# EAGLE design My_Smart_Home_Rev2 (EAGLE 7.1.0)
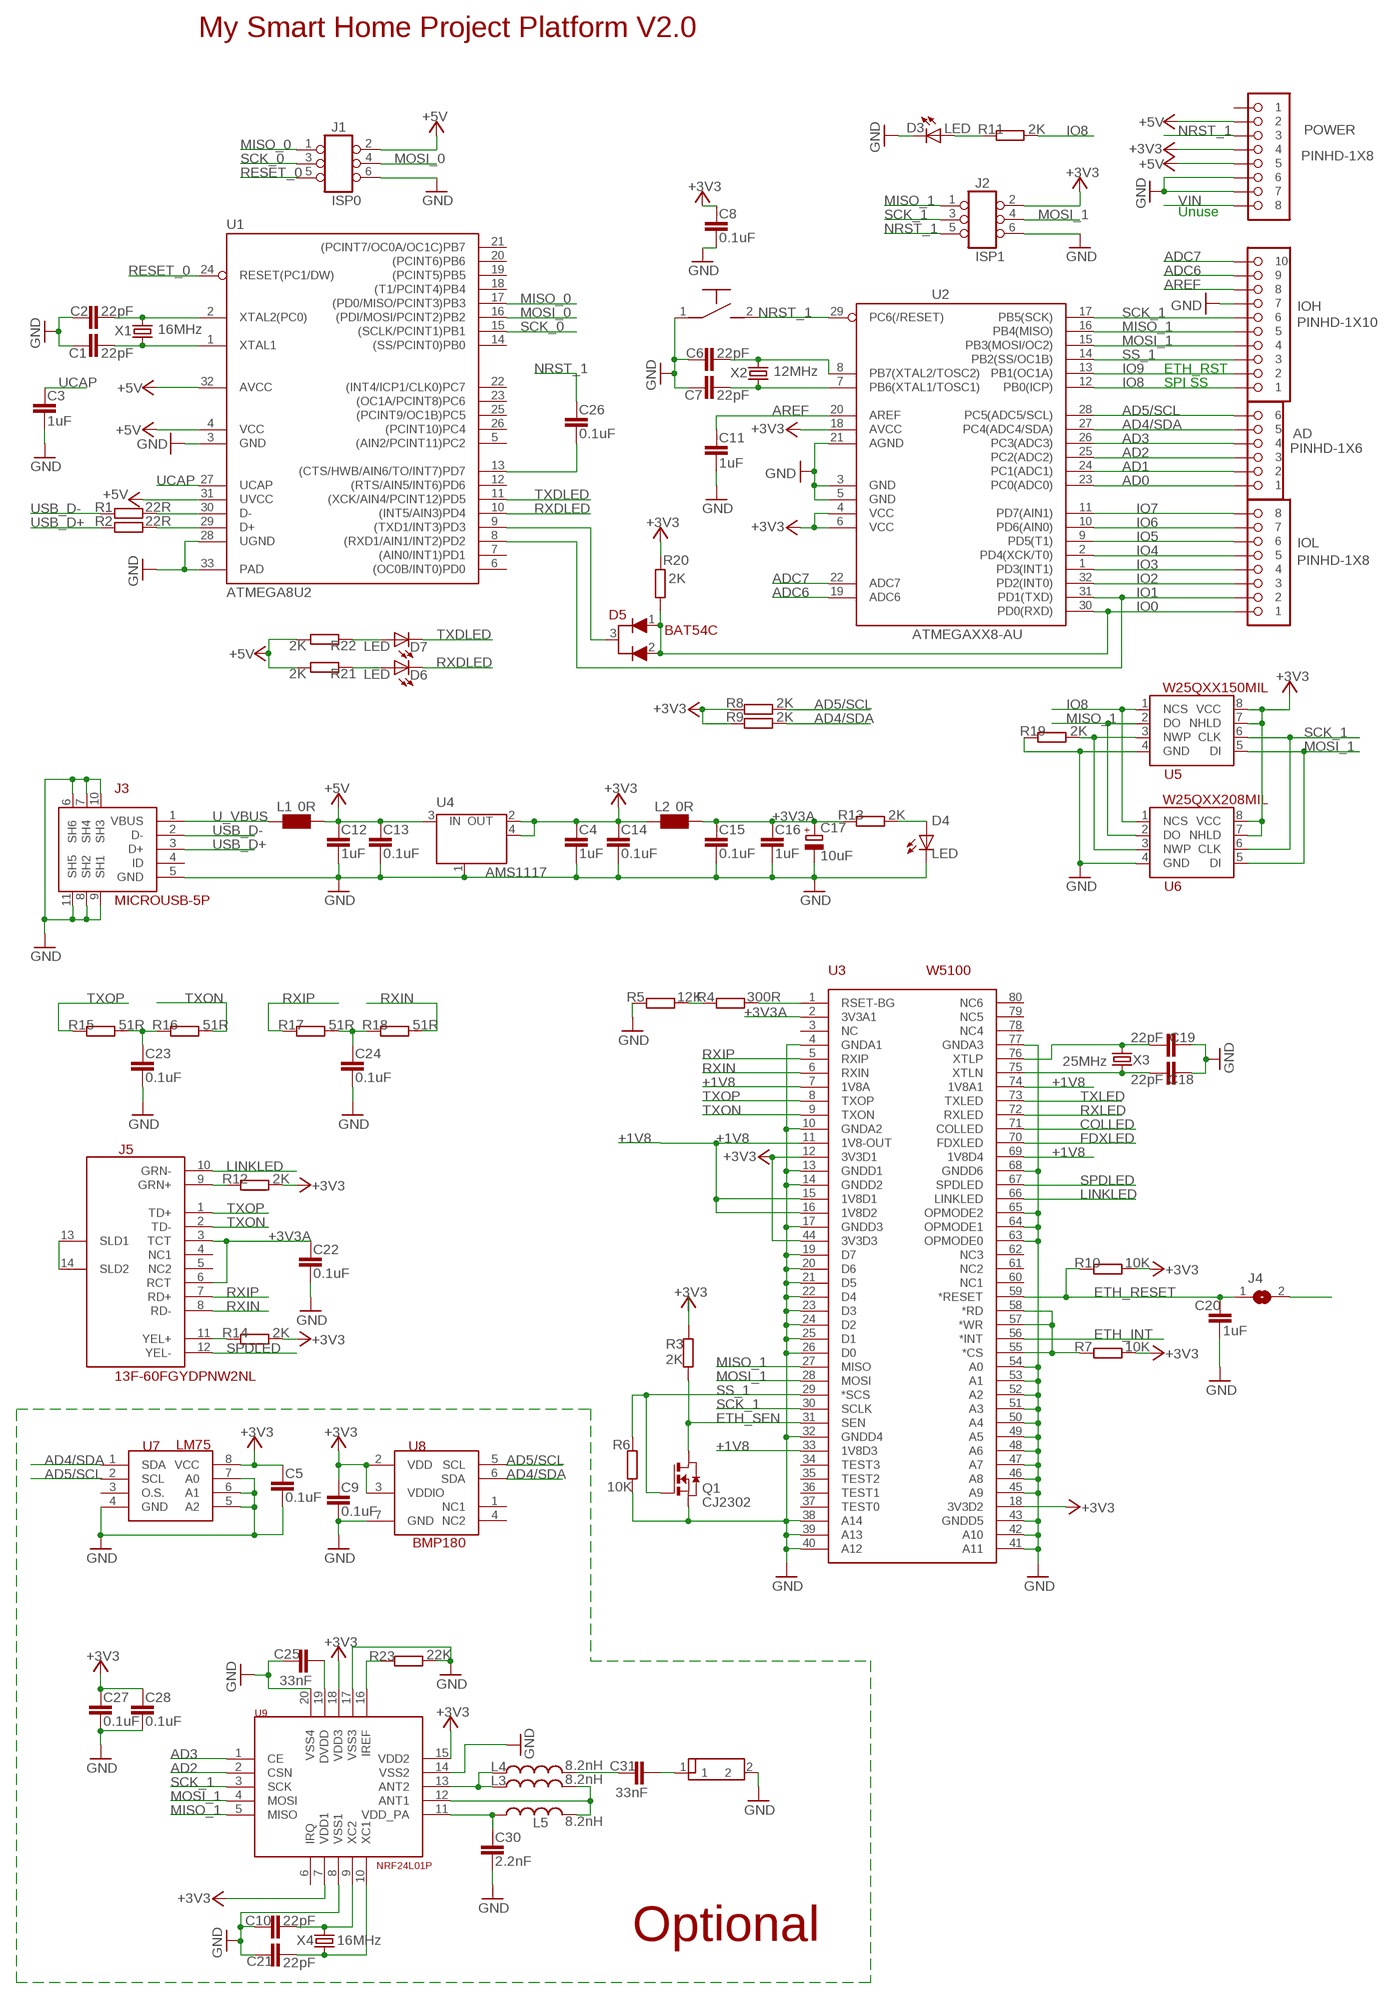
[diagram p0: schematic, sheet 1]

## Parts
AD  PINHD-1X6  [1X06]
ANT1  2.4G_ANT1  [2.4G_PCB_ANT]
C1  22pF  C-NP  [C0603]
C2  22pF  C-NP  [C0603]
C3  1uF  C-NP  [C0603]
C4  1uF  C-NP  [C0603]
C5  0.1uF  C-NP  [C0603]
C6  22pF  C-NP  [C0603]
C7  22pF  C-NP  [C0603]
C8  0.1uF  C-NP  [C0603]
C9  0.1uF  C-NP  [C0603]
C10  22pF  C-NP  [C0603]
C11  1uF  C-NP  [C0603]
C12  1uF  C-NP  [C0603]
C13  0.1uF  C-NP  [C0603]
C14  0.1uF  C-NP  [C0603]
C15  0.1uF  C-NP  [C0603]
C16  1uF  C-NP  [C0603]
C17  10uF  C-POL  [C0805]
C18  22pF  C-NP  [C0603]
C19  22pF  C-NP  [C0603]
C20  1uF  C-NP  [C0603]
C21  22pF  C-NP  [C0603]
C22  0.1uF  C-NP  [C0603]
C23  0.1uF  C-NP  [C0603]
C24  0.1uF  C-NP  [C0603]
C25  33nF  C-NP  [C0603]
C26  0.1uF  C-NP  [C0603]
C27  0.1uF  C-NP  [C0603]
C28  0.1uF  C-NP  [C0603]
C30  2.2nF  C-NP  [C0603]
C31  33nF  C-NP  [C0603]
D3  LED  [LED0805]
D4  LED  [LED0805]
D5  BAT54C  [SOT23]
D6  LED  [LED0805]
D7  LED  [LED0805]
IOH  PINHD-1X10  [1X10]
IOL  PINHD-1X8  [1X08]
J1  ISP0  PINHD-2X3  [2X03]
J2  ISP1  PINHD-2X3  [2X03]
J3  MICROUSB-5P  [MICROUSB-5P-SMD]
J4  JUMPER  [SOLDER_JUMPER]
J5  13F-60FGYDPNW2NL  [13F-60FGYDPNW2NL]
L1  0R  L_M  [R0603]
L2  0R  L_M  [R0603]
L3  8.2nH  L  [R0603]
L4  8.2nH  L  [R0603]
L5  8.2nH  L  [R0603]
POWER  PINHD-1X8  [1X08]
Q1  CJ2302  NMOS-SOT23  [SOT23]
R1  22R  RES  [R0603]
R2  22R  RES  [R0603]
R3  2K  RES  [R0603]
R4  300R  RES  [R0603]
R5  12K  RES  [R0603]
R6  10K  RES  [R0603]
R7  10K  RES  [R0603]
R8  2K  RES  [R0603]
R9  2K  RES  [R0603]
R10  10K  RES  [R0603]
R11  2K  RES  [R0603]
R12  2K  RES  [R0603]
R13  2K  RES  [R0603]
R14  2K  RES  [R0603]
R15  51R  RES  [R0603]
R16  51R  RES  [R0603]
R17  51R  RES  [R0603]
R18  51R  RES  [R0603]
R19  2K  RES  [R0603]
R20  2K  RES  [R0603]
R21  2K  RES  [R0603]
R22  2K  RES  [R0603]
R23  22K  RES  [R0603]
SW2  SW-2  [SW-2P-SMD]
U1  ATMEGA8U2  [MLF32]
U2  ATMEGAXX8-AU  [TQFP32-08]
U3  W5100  [SQFP-S-10X10-80]
U4  AMS1117  [SOT223]
U5  W25QXX150MIL  [8S1]
U6  W25QXX208MIL  [8S2]
U7  LM75  [8S1]
U8  BMP180  [LGA-7P]
U9  NRF24L01P  [QFN20]
X1  16MHz  CRYSTAL  [HC49UP]
X2  12MHz  CRYSTAL  [HC49UP]
X3  25MHz  CRYSTAL  [HC49UP]
X4  16MHz  CRYSTAL  [HC49UP]

## Nets
+1V8: U3.7(1V8A) U3.11(1V8-OUT) U3.15(1V8D1) U3.16(1V8D2) U3.33(1V8D3) U3.69(1V8D4) U3.74(1V8A1)
+3V3 [Power]: C4.2 C5.2 C8.2 C9.2 C14.2 C27.2 C28.2 J2.2 L2.1 POWER.4 R3.2 R7.2 R8.2 R9.2 R10.2 R12.1 R14.1 R20.2 U2.4(VCC) U2.6(VCC) U2.18(AVCC) U3.12(3V3D1) U3.18(3V3D2) U3.44(3V3D3) U4.2(OUT) U4.4(OUT) U5.7(NHLD) U5.8(VCC) U6.7(NHLD) U6.8(VCC) U7.8(VCC) U8.2(VDD) U8.3(VDDIO) U9.7(VDD1) U9.15(VDD2) U9.18(VDD3)
+3V3A [VA]: C15.2 C16.2 C17.1(+) C22.2 J5.3(TCT) J5.6(RCT) L2.2 R13.2 U3.2(3V3A1)
+5V [VA]: C12.2 C13.2 J1.2 L1.2 POWER.2 POWER.5 R21.1 R22.1 U1.4(VCC) U1.31(UVCC) U1.32(AVCC) U4.3(IN)
AD0: AD.1 U2.23(PC0(ADC0))
AD1: AD.2 U2.24(PC1(ADC1))
AD2: AD.3 U2.25(PC2(ADC2)) U9.2(CSN)
AD3: AD.4 U2.26(PC3(ADC3)) U9.1(CE)
AD4/SDA: AD.5 R9.1 U2.27(PC4(ADC4/SDA)) U7.1(SDA) U8.6(SDA)
AD5/SCL: AD.6 R8.1 U2.28(PC5(ADC5/SCL)) U7.2(SCL) U8.5(SCL)
ADC6: IOH.9 U2.19(ADC6)
ADC7: IOH.10 U2.22(ADC7)
AREF: C11.2 IOH.8 U2.20(AREF)
COLLED: U3.71(COLLED)
ETH_INT: U3.56(*INT)
ETH_RESET: C20.2 J4.1 R10.1 U3.59(*RESET)
ETH_SEN: Q1.3(D) R3.1 U3.31(SEN)
FDXLED: U3.70(FDXLED)
GND [Power]: ANT1.2 C1.1 C2.1 C3.1 C4.1 C5.1 C6.1 C7.1 C8.1 C9.1 C10.1 C11.1 C12.1 C13.1 C14.1 C15.1 C16.1 C17.2(-) C18.1 C19.1 C20.1 C21.1 C22.1 C23.1 C24.1 C25.2 C27.1 C28.1 C30.1 D3.C D4.C IOH.7 J1.6 J2.6 J3.5(GND) J3.6(SH6) J3.7(SH4) J3.8(SH2) J3.9(SH1) J3.10(SH3) J3.11(SH5) POWER.6 POWER.7 Q1.2(S) R5.1 R6.1 R19.2 R23.1 SW2.1 U1.3(GND) U1.28(UGND) U1.33(PAD) U2.3(GND) U2.5(GND) U2.21(AGND) U3.4(GNDA1) U3.10(GNDA2) U3.13(GNDD1) U3.14(GNDD2) U3.17(GNDD3) U3.19(D7) U3.20(D6) U3.21(D5) U3.22(D4) U3.23(D3) U3.24(D2) U3.25(D1) U3.26(D0) U3.32(GNDD4) U3.38(A14) U3.39(A13) U3.40(A12) U3.41(A11) U3.42(A10) U3.43(GNDD5) U3.45(A9) U3.46(A8) U3.47(A7) U3.48(A6) U3.49(A5) U3.50(A4) U3.51(A3) U3.52(A2) U3.53(A1) U3.54(A0) U3.63(OPMODE0) U3.64(OPMODE1) U3.65(OPMODE2) U3.68(GNDD6) U3.77(GNDA3) U4.1(GND/ADJ) U5.4(GND) U6.4(GND) U7.4(GND) U7.5(A2) U7.6(A1) U7.7(A0) U8.7(GND) U9.8(VSS1) U9.14(VSS2) U9.17(VSS3) U9.20(VSS4)
IO0: D5.1 D5.2 IOL.1 R20.1 U2.30(PD0(RXD))
IO1: IOL.2 U1.8((RXD1/AIN1/INT2)PD2) U2.31(PD1(TXD))
IO2: IOL.3 U2.32(PD2(INT0))
IO3: IOL.4 U2.1(PD3(INT1))
IO4: IOL.5 U2.2(PD4(XCK/T0))
IO5: IOL.6 U2.9(PD5(T1))
IO6: IOL.7 U2.10(PD6(AIN0))
IO7: IOL.8 U2.11(PD7(AIN1))
IO8: IOH.1 R11.1 U2.12(PB0(ICP)) U5.1(NCS) U6.1(NCS)
IO9: IOH.2 J4.2 U2.13(PB1(OC1A))
LINKLED: J5.10(GRN-) U3.66(LINKLED)
MISO_0: J1.1 U1.17((PD0/MISO/PCINT3)PB3)
MISO_1: IOH.5 J2.1 U2.16(PB4(MISO)) U3.27(MISO) U5.2(DO) U6.2(DO) U9.5(MISO)
MOSI_0: J1.4 U1.16((PDI/MOSI/PCINT2)PB2)
MOSI_1: IOH.4 J2.4 U2.15(PB3(MOSI/OC2)) U3.28(MOSI) U5.5(DI) U6.5(DI) U9.4(MOSI)
N$1: C2.2 U1.2(XTAL2(PC0)) X1.2
N$2: C1.2 U1.1(XTAL1) X1.1
N$3: C18.2 U3.75(XTLN) X3.2
N$4: R7.1 U3.55(*CS) U3.57(*WR) U3.58(*RD)
N$5: C19.2 U3.76(XTLP) X3.1
N$6: C10.2 U9.9(XC2) X4.2
N$7: D5.3 U1.9((TXD1/INT3)PD3)
N$8: C26.1 U1.13((CTS/HWB/AIN6/TO/INT7)PD7)
N$9: R1.2 U1.30(D-)
N$10: D7.A R22.2
N$11: R2.2 U1.29(D+)
N$12: C21.2 U9.10(XC1) X4.1
N$13: L3.1 L4.1 U9.13(ANT2)
N$14: D4.A R13.1
N$15: D3.A R11.2
N$16: C6.2 U2.8(PB7(XTAL2/TOSC2)) X2.2
N$17: C7.2 U2.7(PB6(XTAL1/TOSC1)) X2.1
N$18: R4.2 U3.1(RSET-BG)
N$19: R4.1 R5.2
N$20: J5.11(YEL+) R14.2
N$22: J5.9(GRN+) R12.2
N$23: C23.2 R15.1 R16.2
N$24: D6.A R21.2
N$25: R23.2 U9.16(IREF)
N$26: J5.13(SLD1) J5.14(SLD2)
N$27: C25.1 U9.19(DVDD)
N$28: C24.2 R17.1 R18.2
N$29: L3.2 L5.2 U9.12(ANT1)
N$30: C30.2 L5.1 U9.11(VDD_PA)
N$31: R19.1 U5.3(NWP) U6.3(NWP)
N$32: ANT1.1 C31.1
N$34: C31.2 L4.2
NRST_1: C26.2 J2.5 POWER.3 SW2.2 U2.29(PC6(/RESET))
RESET_0: J1.5 U1.24(RESET(PC1/DW))
RXDLED: D6.C U1.10((INT5/AIN3)PD4)
RXIN: J5.8(RD-) R18.1 U3.6(RXIN)
RXIP: J5.7(RD+) R17.2 U3.5(RXIP)
RXLED: U3.72(RXLED)
SCK_0: J1.3 U1.15((SCLK/PCINT1)PB1)
SCK_1: IOH.6 J2.3 U2.17(PB5(SCK)) U3.30(SCLK) U5.6(CLK) U6.6(CLK) U9.3(SCK)
SPDLED: J5.12(YEL-) U3.67(SPDLED)
SS_1: IOH.3 Q1.1(G) R6.2 U2.14(PB2(SS/OC1B)) U3.29(*SCS)
TXDLED: D7.C U1.11((XCK/AIN4/PCINT12)PD5)
TXLED: U3.73(TXLED)
TXON: J5.2(TD-) R16.1 U3.9(TXON)
TXOP: J5.1(TD+) R15.2 U3.8(TXOP)
U_VBUS: J3.1(VBUS) L1.1
UCAP: C3.2 U1.27(UCAP)
USB_D+: J3.3(D+) R2.1
USB_D-: J3.2(D-) R1.1
VIN: POWER.8
Unconnected: J3.4(ID) J5.4(NC1) J5.5(NC2) POWER.1 U1.5((AIN2/PCINT11)PC2) U1.6((OC0B/INT0)PD0) U1.7((AIN0/INT1)PD1) U1.12((RTS/AIN5/INT6)PD6) U1.14((SS/PCINT0)PB0) U1.18((T1/PCINT4)PB4) U1.19((PCINT5)PB5) U1.20((PCINT6)PB6) U1.21((PCINT7/OC0A/OC1C)PB7) U1.22((INT4/ICP1/CLK0)PC7) U1.23((OC1A/PCINT8)PC6) U1.25((PCINT9/OC1B)PC5) U1.26((PCINT10)PC4) U3.3(NC) U3.34(TEST3) U3.35(TEST2) U3.36(TEST1) U3.37(TEST0) U3.60(NC1) U3.61(NC2) U3.62(NC3) U3.78(NC4) U3.79(NC5) U3.80(NC6) U7.3(O.S.) U8.1(NC1) U8.4(NC2) U9.6(IRQ)

## Notes on the sheet
- My Smart Home Project Platform V2.0
- Unuse
- ETH_RST
- SPI SS
- Optional

## Library data of the parts
AD = Hell-Prototypes:PINHD-1X6
ANT1 = Hell-Prototypes:2.4G_ANT1
C1-C16 C18-C28 C30 C31 = Hell-Prototypes:C-NP
C17 = Hell-Prototypes:C-POL
D3 D4 D6 D7 = Hell-Prototypes:LED
D5 = Hell-Prototypes:BAT54C
IOH = Hell-Prototypes:PINHD-1X10
IOL POWER = Hell-Prototypes:PINHD-1X8
J1 J2 = Hell-Prototypes:PINHD-2X3
J3 = Hell-Prototypes:MICROUSB-5P
J4 = Hell-Prototypes:JUMPER
J5 = Hell-Prototypes:13F-60FGYDPNW2NL
L1 L2 = Hell-Prototypes:L_M
L3-L5 = Hell-Prototypes:L
Q1 = Hell-Prototypes:NMOS-SOT23
R1-R23 = Hell-Prototypes:RES
SW2 = Hell-Prototypes:SW-2
U1 = Hell-Prototypes:ATMEGA8U2
U2 = Hell-Prototypes:ATMEGAXX8: MICROCONTROLLER 8 Kbytes FLASH 1 kbytes SRAM 512 bytes EEPROM USART 6-channel 10 bit ADC 2-channel 8 bit ADC Source: avr.lbr
U3 = Hell-Prototypes:W5100
U4 = Hell-Prototypes:AMS1117
U5 U6 = Hell-Prototypes:W25QXX
U7 = Hell-Prototypes:LM75
U8 = Hell-Prototypes:BMP180
U9 = Hell-Prototypes:NRF24L01P
X1-X4 = Hell-Prototypes:CRYSTAL

## Net classes
0 default: width 0.203 mm, drill 0.406 mm, clearance 0.203 mm
1 Power: width 0.254 mm, drill 0.508 mm, clearance 0.254 mm to class 0, clearance 0.254 mm
2 VA: width 0.305 mm, drill 0.61 mm, clearance 0.203 mm to class 0, clearance 0.203 mm to class 1, clearance 0.203 mm

## Board
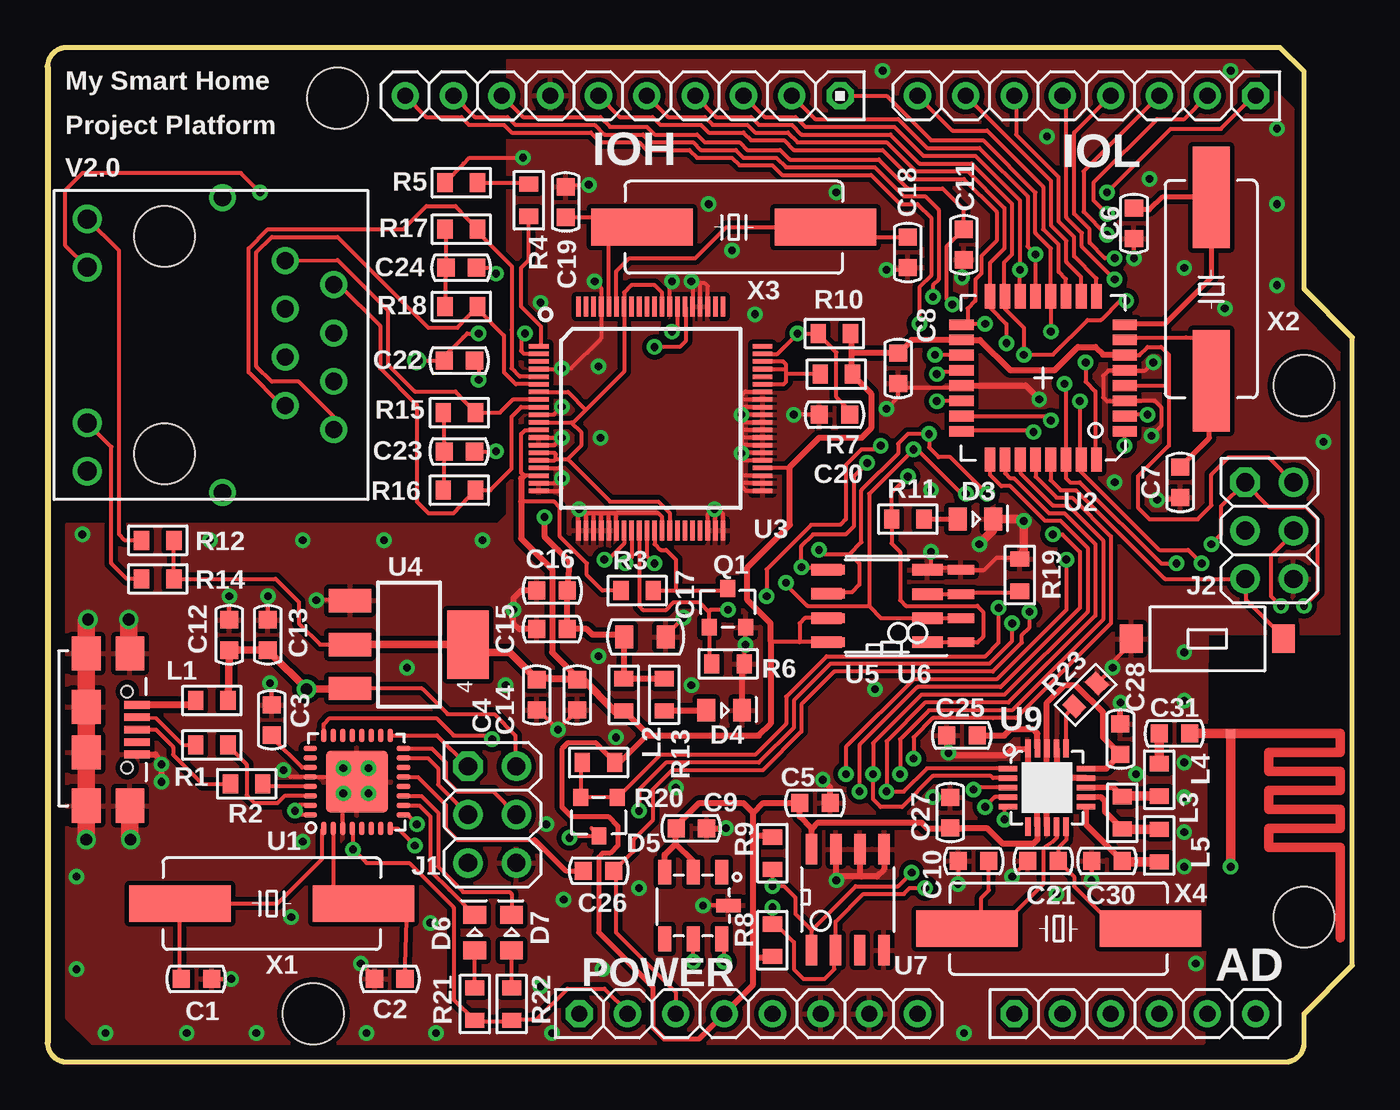
[diagram p1: board, top side]
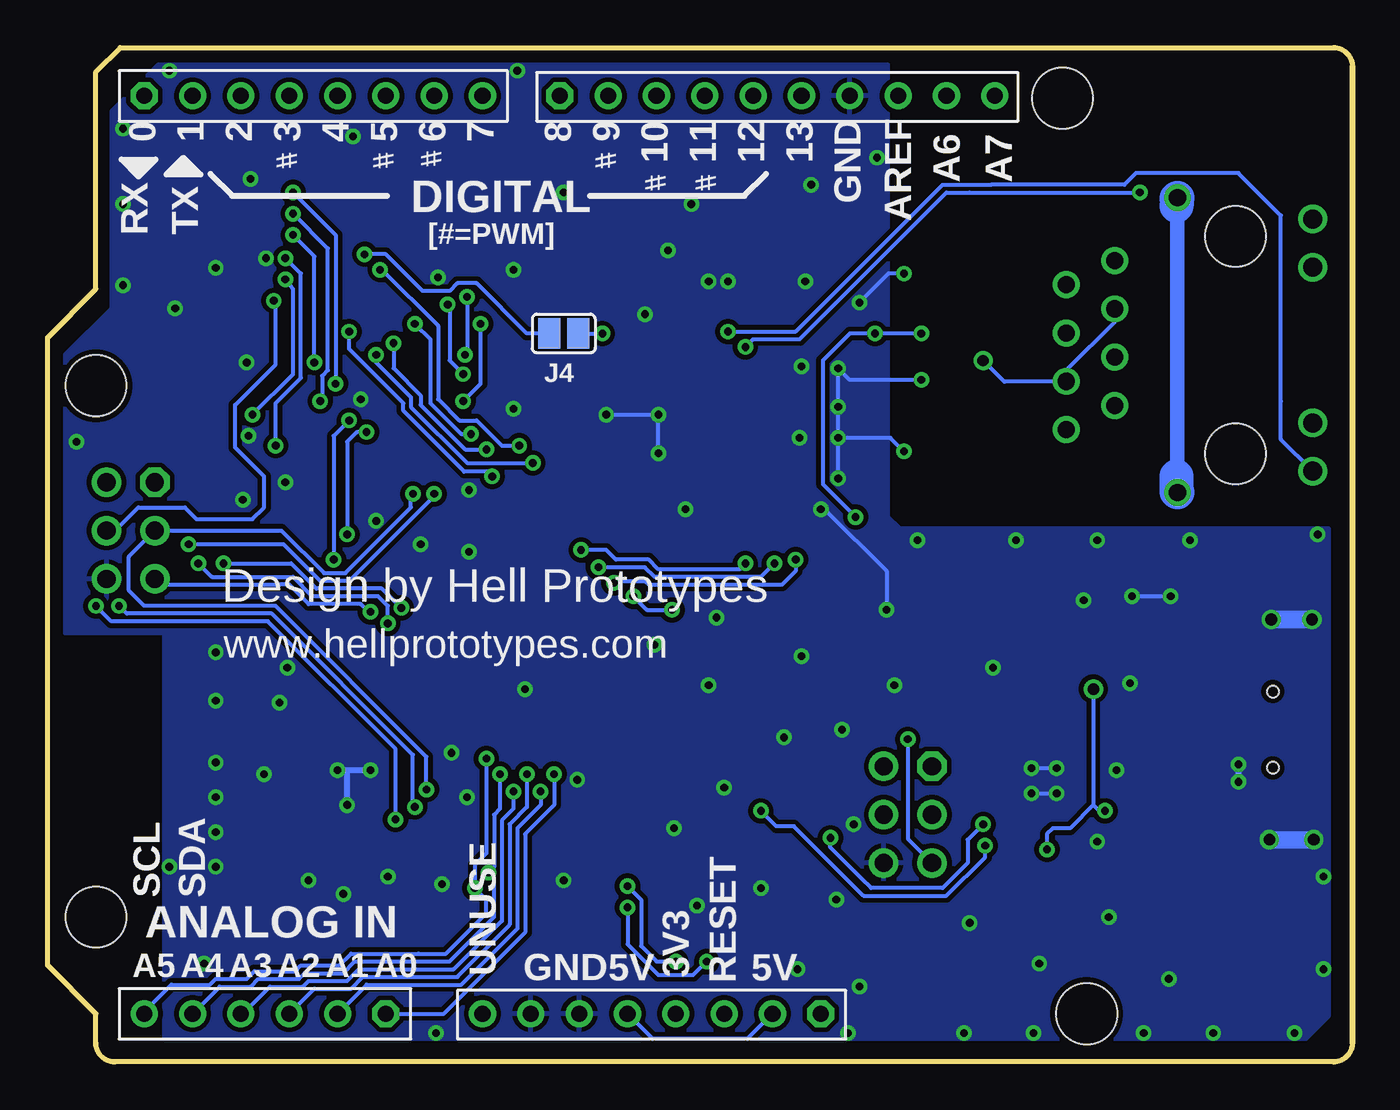
[diagram p2: board, bottom side, seen from below]

Size 68.58 x 53.34 mm. Coordinates in mm from the lower left corner, seen from the top.
Outline: 66.04,2.54 68.58,5.08 68.58,38.1 66.04,40.64 66.04,52.07 64.77,53.34 1,53.34 arc90 0,52.34 0,1 arc90 1,0 65.04,0 arc90 66.04,1 66.04,2.54
Copper layers (1*16): Top 0.035mm / dielectric 1.5mm / Bottom 0.035mm
Design rules "default *": minimum track width 8mil, minimum drill 12mil, track to track 8mil, track to pad 8mil, pad to pad 8mil, via to via 8mil, smd to smd 8mil, copper to edge 12mil, drill to drill 16mil, minimum pad ring 10mil, minimum via ring 8mil, stop-mask expansion 4mil, vias tented up to drill 20mil, thermal gap 10mil
Holes 3.2 mm at 13.97,2.54 15.24,50.67 66.04,35.56 66.04,7.62

### Footprints (pad centres in the part's own frame; a part is rotated, then mirrored left to right if it is on the bottom)
1X06 = drill 0.85 pad 1.422 octagon: 1 -6.35,0 | drill 0.85 pad 1.422: 2 -3.81,0; 3 -1.27,0; 4 1.27,0; 5 3.81,0; 6 6.35,0
2.4G_PCB_ANT = smd 0.5 x 0.5: 1 0,0; 2 7,0
C0603 = smd 0.9 x 0.95: 1 -0.8,0; 2 0.8,0
C0805 = smd 0.94 x 1.194: 1 -1.092,0; 2 1.092,0
LED0805 = smd 1.194 x 0.94: A 0,-0.94; C 0,0.94
SOT23 = smd 0.787 x 0.889: 1 0.991,1.016; 2 -0.94,1.016; 3 0.025,-1.016
1X10 = drill 0.85 pad 1.422 octagon: 1 -11.43,0 | drill 0.85 pad 1.422: 2 -8.89,0; 3 -6.35,0; 4 -3.81,0; 5 -1.27,0; 6 1.27,0; 7 3.81,0; 8 6.35,0; 9 8.89,0; 10 11.43,0
1X08 = drill 0.85 pad 1.422 octagon: 1 -8.89,0 | drill 0.85 pad 1.422: 2 -6.35,0; 3 -3.81,0; 4 -1.27,0; 5 1.27,0; 6 3.81,0; 7 6.35,0; 8 8.89,0
2X03 = drill 0.95 pad 1.55 octagon: 1 -2.54,-1.27 | drill 0.95 pad 1.55: 2 -2.54,1.27; 3 0,-1.27; 4 0,1.27; 5 2.54,-1.27; 6 2.54,1.27
MICROUSB-5P-SMD = smd 0.4 x 1.35: 1 -1.3,2.675; 2 -0.65,2.675; 3 0,2.675; 4 0.65,2.675; 5 1.3,2.675 | smd 1.8 x 1.5: 6 4,2.3; 7 4,0; 8 1.2,0; 9 -1.2,0; 10 -4,0; 11 -4,2.3 | hole 0.6: -2,2.15; 2,2.15
SOLDER_JUMPER = smd 1.168 x 1.6: 1 -0.762,0; 2 0.762,0
13F-60FGYDPNW2NL = drill 0.9: 1 -4.445,-2.54; 2 -3.175,0; 3 -1.905,-2.54; 4 -0.635,0; 5 0.635,-2.54; 6 1.905,0; 7 3.175,-2.54; 8 4.445,0; 13 -7.75,-5.84; 14 7.75,-5.84 | drill 1: 9 -6.63,-12.95; 10 -4.09,-12.95; 11 4.09,-12.95; 12 6.63,-12.95 | hole 3.2: -5.715,-8.89; 5.715,-8.89
R0603 = smd 0.8 x 1: 1 -0.85,0; 2 0.85,0
SW-2P-SMD = smd 1.2 x 1.5: 1 -4,0; 2 4,0
MLF32 = smd 0.7 x 0.28: 1 -2.45,1.75; 2 -2.45,1.25; 3 -2.45,0.75; 4 -2.45,0.25; 5 -2.45,-0.25; 6 -2.45,-0.75; 7 -2.45,-1.25; 8 -2.45,-1.75; 17 2.45,-1.75; 18 2.45,-1.25; 19 2.45,-0.75; 20 2.45,-0.25; 21 2.45,0.25; 22 2.45,0.75; 23 2.45,1.25; 24 2.45,1.75 | smd 0.28 x 0.7: 9 -1.75,-2.45; 10 -1.25,-2.45; 11 -0.75,-2.45; 12 -0.25,-2.45; 13 0.25,-2.45; 14 0.75,-2.45; 15 1.25,-2.45; 16 1.75,-2.45; 25 1.75,2.45; 26 1.25,2.45; 27 0.75,2.45; 28 0.25,2.45; 29 -0.25,2.45; 30 -0.75,2.45; 31 -1.25,2.45; 32 -1.75,2.45 | smd 3.254 x 3.254: 33 0,0
TQFP32-08 = smd 1.27 x 0.559: 1 -4.293,2.8; 2 -4.293,2; 3 -4.293,1.2; 4 -4.293,0.4; 5 -4.293,-0.4; 6 -4.293,-1.2; 7 -4.293,-2; 8 -4.293,-2.8; 17 4.293,-2.8; 18 4.293,-2; 19 4.293,-1.2; 20 4.293,-0.4; 21 4.293,0.4; 22 4.293,1.2; 23 4.293,2; 24 4.293,2.8 | smd 0.559 x 1.27: 9 -2.8,-4.293; 10 -2,-4.293; 11 -1.2,-4.293; 12 -0.4,-4.293; 13 0.4,-4.293; 14 1.2,-4.293; 15 2,-4.293; 16 2.8,-4.293; 25 2.8,4.293; 26 2,4.293; 27 1.2,4.293; 28 0.4,4.293; 29 -0.4,4.293; 30 -1.2,4.293; 31 -2,4.293; 32 -2.8,4.293
SQFP-S-10X10-80 = smd 0.241 x 1.041: 1 -3.8,-5.879; 2 -3.4,-5.879; 3 -3,-5.879; 4 -2.6,-5.879; 5 -2.2,-5.879; 6 -1.8,-5.879; 7 -1.4,-5.879; 8 -1,-5.879; 9 -0.6,-5.879; 10 -0.2,-5.879; 11 0.2,-5.879; 12 0.6,-5.879; 13 1,-5.879; 14 1.4,-5.879; 15 1.8,-5.879; 16 2.2,-5.879; 17 2.6,-5.879; 18 3,-5.879; 19 3.4,-5.879; 20 3.8,-5.879; 41 3.8,5.879; 42 3.4,5.879; 43 3,5.879; 44 2.6,5.879; 45 2.2,5.879; 46 1.8,5.879; 47 1.4,5.879; 48 1,5.879; 49 0.6,5.879; 50 0.2,5.879; 51 -0.2,5.879; 52 -0.6,5.879; 53 -1,5.879; 54 -1.4,5.879; 55 -1.8,5.879; 56 -2.2,5.879; 57 -2.6,5.879; 58 -3,5.879; 59 -3.4,5.879; 60 -3.8,5.879 | smd 1.041 x 0.241: 21 5.879,-3.8; 22 5.879,-3.4; 23 5.879,-3; 24 5.879,-2.6; 25 5.879,-2.2; 26 5.879,-1.8; 27 5.879,-1.4; 28 5.879,-1; 29 5.879,-0.6; 30 5.879,-0.2; 31 5.879,0.2; 32 5.879,0.6; 33 5.879,1; 34 5.879,1.4; 35 5.879,1.8; 36 5.879,2.2; 37 5.879,2.6; 38 5.879,3; 39 5.879,3.4; 40 5.879,3.8; 61 -5.879,3.8; 62 -5.879,3.4; 63 -5.879,3; 64 -5.879,2.6; 65 -5.879,2.2; 66 -5.879,1.8; 67 -5.879,1.4; 68 -5.879,1; 69 -5.879,0.6; 70 -5.879,0.2; 71 -5.879,-0.2; 72 -5.879,-0.6; 73 -5.879,-1; 74 -5.879,-1.4; 75 -5.879,-1.8; 76 -5.879,-2.2; 77 -5.879,-2.6; 78 -5.879,-3; 79 -5.879,-3.4; 80 -5.879,-3.8
SOT223 = smd 1.219 x 2.235: 1 -2.311,-3.099; 2 0,-3.099; 3 2.311,-3.099 | smd 3.6 x 2.2: 4 0,3.099
8S1 = smd 0.6 x 1.6: 1 -1.905,-2.654; 2 -0.645,-2.654; 3 0.625,-2.654; 4 1.895,-2.654; 5 1.905,2.654; 6 0.635,2.654; 7 -0.635,2.654; 8 -1.905,2.654
8S2 = smd 0.5 x 1.4: 1 -1.905,-3.404; 2 -0.645,-3.404; 3 0.625,-3.404; 4 1.895,-3.404; 5 1.905,3.404; 6 0.635,3.404; 7 -0.635,3.404; 8 -1.905,3.404
LGA-7P = smd 0.7 x 1.3: 1 -1.5,-1.75; 2 0,-1.75; 3 1.5,-1.75; 4 1.5,1.75; 5 0,1.75; 6 -1.5,1.75 | smd 1.3 x 0.7: 7 -1.85,0
QFN20 = smd 0.95 x 0.3: 1 -2.05,1; 2 -2.05,0.5; 3 -2.05,0; 4 -2.05,-0.5; 5 -2.05,-1; 11 2.05,-1; 12 2.05,-0.5; 13 2.05,0; 14 2.05,0.5; 15 2.05,1 | smd 0.3 x 0.95: 6 -1,-2.05; 7 -0.5,-2.05; 8 0,-2.05; 9 0.5,-2.05; 10 1,-2.05; 16 1,2.05; 17 0.5,2.05; 18 0,2.05; 19 -0.5,2.05; 20 -1,2.05
HC49UP = smd 5.334 x 1.93: 1 -4.826,0; 2 4.826,0

### Placement (x,y rotation side)
AD  57.15,2.54 0 top
ANT1  62.18,17.27 270 top
C1  7.82,4.37 180 top
C2  17.98,4.37 0 top
C3  11.79,17.98 270 top
C4  25.7,19.3 90 top
C5  40.34,13.61 180 top
C6  57.1,44.09 90 top
C7  59.54,30.48 90 top
C8  44.7,36.47 90 top
C9  33.83,12.29 180 top
C10  48.67,10.57 0 top
C11  48.16,42.98 90 top
C12  9.55,22.45 270 top
C13  11.58,22.45 270 top
C14  27.84,19.3 90 top
C15  26.52,22.76 0 top
C16  26.52,24.79 0 top
C17  31.39,22.35 0 top
C18  45.21,42.57 90 top
C19  27.23,45.21 270 top
C20  41.35,34.04 0 top
C21  52.32,10.57 0 top
C22  21.64,36.88 180 top
C23  21.64,32.11 180 top
C24  21.74,41.76 180 top
C25  48.06,17.17 180 top
C26  28.96,10.06 0 top
C27  47.45,13.11 270 top
C28  56.39,16.97 270 top
C30  55.68,10.57 0 top
C31  59.23,17.27 180 top
D3  48.77,28.55 270 top
D4  35.56,18.49 270 top
D5  28.96,12.9 0 top
D6  22.45,6.81 0 top
D7  24.38,6.81 0 top
IOH  30.23,50.8 180 top
IOL  54.61,50.8 180 top
J1  23.37,13 270 top
J2  64.21,27.94 270 top
J3  2.03,17.48 270 top
J4  41.45,38.3 180 bottom
J5  15.04,37.69 270 top
L1  8.64,19 0 top
L2  30.28,19.3 90 top
L3  56.49,13.11 270 top
L4  58.42,14.83 90 top
L5  58.42,11.38 90 top
POWER  36.83,2.54 0 top
Q1  35.76,23.88 180 top
R1  8.64,16.66 0 top
R2  10.46,14.63 0 top
R3  30.99,24.79 180 top
R4  25.3,45.31 270 top
R5  21.74,46.23 0 top
R6  35.76,20.93 180 top
R7  41.45,36.17 0 top
R8  38.1,6.4 270 top
R9  38.1,10.97 90 top
R10  41.35,38.3 0 top
R11  45.21,28.55 0 top
R12  5.79,27.43 180 top
R13  32.41,19.3 90 top
R14  5.79,25.4 180 top
R15  21.64,34.14 0 top
R16  21.64,30.07 180 top
R17  21.74,43.79 0 top
R18  21.74,39.73 180 top
R19  51.1,25.6 90 top
R20  28.96,15.75 0 top
R21  22.45,3.05 90 top
R22  24.38,3.05 90 top
R23  54.56,19.3 225 top
SW2  60.96,22.25 0 top
U1  16.26,14.73 90 top
U2  52.32,35.97 180 top
U3  31.7,33.83 270 top
U4  19,21.95 270 top
U5  43.59,23.98 90 top
U6  44.6,23.98 90 top
U7  42.06,8.53 0 top
U8  33.93,8.23 180 top
U9  52.53,14.43 0 top
X1  11.79,8.33 0 top
X2  61.16,40.64 90 top
X3  36.07,43.89 0 top
X4  53.14,7.01 180 top

### Tracks (layer width: path | path; a pad name or v marks a point on that pad's centre or on a via)
+1V8
  Top 0.203: 27.53,33.63 27.64,33.63 28.3,34.29 | U3.69 32.3,40.45 31.9,40.84 30.68,40.84 30.3,40.46 U3.74 30.3,36.29 28.3,34.29 | 26.72,31.7 26.65,31.63 U3.16 | 26.72,31.7 26.72,31.96 26.65,32.03 U3.15 | 26.72,31.7 27.33,31.7 | U3.11 27.53,33.63 | U3.7 27.35,35.23 28.3,34.29 | U3.33 32.7,28.87 32.11,29.46 29.57,29.46 27.33,31.7 | 27.53,33.63 28.04,33.12 28.04,32.41 27.33,31.7
+3V3
  Top 0.203: R12.1 R14.1 11.99,25.4 13.21,24.18 13.21,23.06 14.33,21.95 U4.2 | U3.12 25.09,33.22 24.89,33.02 24.89,30.99 25.05,30.83 U3.18 25.04,30.83 | R3.2 29.16,24.79 28.35,25.6 28.35,26.21 26.92,27.64 26.92,29.16 26.62,29.46 24.89,29.46 | 42.24,36.27 R7.2 42.34,36.09 | 39.01,31.29 38.95,31.23 U3.44 | L2.1 30.35,18.41 | U4.4 22.5,21.54 | 25.63,20.19 25.81,20.19 | 58.93,35.56 58.93,32.41 57.3,30.79 57.3,29.16 57.91,28.55 60.45,28.55 61.16,29.26 61.16,30.89 62.08,31.8 64.16,31.8 J2.2 | U2.6 57.38,37.17 57.81,37.59 58.52,37.59 58.93,37.19 58.93,35.56 | U2.4 58.92,35.57 58.93,35.56 | 39.52,22.07 U5.8 U6.8 | 39.52,22.07 38.08,22.07 38,22.15 | 39.52,22.07 39.52,23.06 39.8,23.34 U5.7 U6.7 | C8.2 44.51,37.27 44.5,37.29
  Top 0.254: U2.4 | 56.6,37.19 U2.6 | 31.55,17.22 30.07,15.75 R20.2 28.83,16.76 27.33,16.76 27.03,16.46 27.03,13.41 27.53,12.9 29.46,12.9 29.97,12.39 29.97,11.38 29.57,10.97 29.16,10.97 28.96,10.77 28.96,6.81 31.8,3.96 31.8,1.83 32.41,1.22 34.24,1.22 POWER.4
  Top 0.305: 56.6,37.19 55.47,37.19 55.07,37.59 54.15,37.59 52.93,36.37 50.6,36.37 49,37.97 U2.18 45.41,37.97 C8.2 | 25.04,30.83 24.89,30.68 24.89,29.46 24.89,27.53 26.52,25.91 26.52,21.54 27.84,20.22 C14.2 28.07,20.19 | C4.2 25.81,20.19 | 29.84,18.41 L2.1 | R10.2 42.24,37.29 | 42.24,37.29 42.24,36.27 | 42.34,36.09 43.28,35.15 43.28,33.33 42.77,32.82 40.54,32.82 39.01,31.29 39.01,28.25 36.78,26.01 36.78,24.28 38,23.06 38,22.15 38,17.78 37.39,17.17 31.6,17.17 31.55,17.22 30.35,18.41 | POWER.4 37.08,4.06 37.08,5.49 | 37.08,5.49 37.08,11.89 | 37.08,11.89 37.08,13.11 | 37.08,13.11 37.59,13.61 C5.2 39.52,13.6 39.52,12.9 40.16,12.27 | R9.2 38.04,11.89 37.08,11.89 | R8.2 38.04,5.49 37.08,5.49 | 37.08,13.11 36.58,13.61 34.24,13.61 33.12,12.5 33.12,12.38 C9.2 33.02,11.48 | U8.3 32.43,10.89 33.02,11.48 | U8.2 33.93,10.57 33.02,11.48 | U7.8 40.16,12.27 | 40.16,12.27 40.49,12.6 45.92,12.6 46.23,12.29 48.04,12.29 C27.2 49.37,12.31 50.19,11.48 51.82,11.48 52.03,11.69 U9.7 52.03,14.44 52.53,14.94 U9.18 52.53,18.9 53.44,19.81 54.05,19.81 55.47,18.39 55.47,17.07 56.38,16.17 C28.2 55.65,15.43 U9.15 | 44.5,37.29 42.24,37.29
  Top 0.406: U4.2 U4.4 | 25.81,20.19 C14.2 | 28.07,20.19 29.84,18.41 | 22.5,21.54 24.28,21.54 25.63,20.19
+3V3A  (via drill 0.41, 0.6)
  Top 0.203: v19.41,36.88 C22.2 20.75,37.01 21.84,38.1 22.05,38.3 v22.66,38.3 | U3.2 25.05,37.23 24.89,37.39 24.89,38.1 v25.09,38.3
  Top 0.305: R13.2 L2.2 30.3,20.22 C17.1 30.28,22.38 30.28,22.66 30.07,22.45 28.65,22.45 28.35,22.76 C15.2 C16.2 27.41,26.34 26.82,26.92 26.11,27.64 v26.11,28.65
  Bottom 0.203: J5.3 12.5,38.91 15.04,36.37 15.04,35.87 J5.6 18.29,35.76 v19.41,36.88 | v22.66,38.3 v25.09,38.3 26.42,38.3 27.84,36.88 27.84,30.38 v26.11,28.65
+5V  (via drill 0.41, 0.61)
  Top 0.203: 9.55,21.54 C12.2 | C13.2 11.68,21.54 | 15.85,19.61 U4.3 19.68,19.63 21.03,18.29 23.47,18.29 24.59,17.17 24.59,15.6 J1.2 | U1.32 13.23,12.98 v13.01,13.21 13.11,13.41 13.21,13.51 13.78,13.51 U1.31 | U1.4 16.05,12.23 v16.05,11.18 16.76,10.46 19,10.46 21.34,8.13 21.34,3.28 R21.1 22.48,2.13 24.49,2.13 24.46,2.16 R22.1 24.46,2.23 25.7,2.23 27.33,3.86 29.26,3.86 30.48,2.64 POWER.2
  Top 0.406: L1.2 9.55,21.54 | C12.2 C13.2 | 11.68,21.54 v13.61,19.61 15.85,19.61
  Bottom 0.203: v13.61,19.61 13.61,13.51 | 13.61,13.51 14.83,12.29 15.75,12.29 16.05,11.99 v16.05,11.18 | v13.01,13.21 13.31,13.21 13.61,13.51 | POWER.2 31.8,1.22 36.78,1.22 POWER.5
AD0  (via drill 0.41)
  Top 0.203: U2.23 52.49,33.97 v52.73,33.73 | v53.54,26.42 53.54,23.77 49.89,20.12 45.52,20.12 41.96,16.56 v41.96,15.14
  Bottom 0.203: v53.54,26.42 53.54,32.92 v52.73,33.73 | AD.1 47.75,2.54 43.48,6.81 43.48,11.99 41.96,13.51 v41.96,15.14
AD1  (via drill 0.41)
  Top 0.203: U2.24 48.09,33.22 48.19,33.12 48.29,33.22 51.71,33.22 v51.82,33.12 | v52.83,27.74 53.34,27.74 54.25,26.82 54.25,23.88 50.09,19.71 45.72,19.71 42.67,16.66 v42.67,14.22
  Bottom 0.203: v52.83,27.74 52.83,32.61 52.32,33.12 v51.82,33.12 | AD.2 51.82,4.06 46.84,4.06 43.89,7.01 43.89,12.29 42.67,13.51 v42.67,14.22
AD2  (via drill 0.41)
  Top 0.203: U2.25 49.52,30.89 50.13,30.28 50.6,30.28 52.43,28.45 53.24,28.45 54.66,27.03 54.66,23.67 50.29,19.3 45.92,19.3 43.38,16.76 v43.38,15.14 43.38,13.82 43.79,13.41 44.91,13.41 46.53,15.04 49.58,15.04 49.69,14.93 U9.2
  Bottom 0.203: AD.3 54.56,3.86 52.63,3.86 52.02,4.47 47.04,4.47 44.3,7.21 44.3,12.5 43.38,13.41 v43.38,15.14
AD3  (via drill 0.41)
  Top 0.203: U2.26 50.32,30.96 50.6,30.68 50.8,30.68 52.63,28.85 53.44,28.85 55.07,27.23 55.07,23.47 50.49,18.9 46.13,18.9 44.09,16.87 v44.09,14.22 45.01,14.22 46.23,15.44 50.46,15.44 U9.1
  Bottom 0.203: AD.4 58.32,2.54 56.9,3.96 55.17,3.96 54.86,4.27 52.83,4.27 52.22,4.88 47.24,4.88 44.7,7.42 44.7,12.7 44.09,13.31 v44.09,14.22
AD4/SDA  (via drill 0.41)
  Top 0.203: U2.27 51.12,30.97 52.83,29.26 53.65,29.26 55.47,27.43 55.47,23.27 50.7,18.49 46.33,18.49 44.81,16.97 v44.81,15.14 | U7.1 40.16,6.93 | 40.16,6.93 42.47,9.25 44.7,9.25 v45.41,9.96 | R9.1 v38.1,9.25 38.71,9.25 39.32,8.64 39.32,7.77 40.16,6.93 | v35.56,5.28 35.56,6.35 U8.6
  Bottom 0.203: AD.5 59.54,3.96 57.91,3.96 57.51,4.37 55.37,4.37 55.07,4.67 53.03,4.67 52.43,5.28 47.45,5.28 45.11,7.62 45.11,9.65 v45.41,9.96 45.11,10.26 45.11,13.01 44.81,13.31 v44.81,15.14 | v38.1,9.25 37.39,8.53 37.39,6.1 36.58,5.28 v35.56,5.28
AD5/SCL  (via drill 0.41)
  Top 0.203: U2.28 51.92,30.78 53.03,29.67 53.85,29.67 55.88,27.64 55.88,23.06 50.9,18.09 49.68,18.09 46.53,18.09 45.52,17.07 v45.52,15.95 | v46.13,9.14 45.31,9.14 45.01,8.84 44.91,8.84 42.88,8.84 41.42,7.38 U7.2 41.35,5.81 41.35,4.88 40.84,4.37 39.73,4.37 39.22,4.88 39.22,6.3 38.27,7.25 R8.1 v38.1,8.13 | v33.93,5.28 U8.5
  Bottom 0.203: AD.6 63.5,2.64 62.08,4.06 60.05,4.06 59.74,4.37 58.12,4.37 57.71,4.78 55.58,4.78 55.27,5.08 53.24,5.08 52.63,5.69 49.07,5.69 47.65,5.69 45.52,7.82 45.52,8.53 v46.13,9.14 46.13,10.36 45.52,10.97 v45.52,15.95 | v33.93,5.28 34.65,4.57 36.47,4.57 37.69,5.79 38.1,6.2 v38.1,8.13
ADC6  (via drill 0.41)
  Top 0.203: v46.63,37.19 48.01,37.19 U2.19 | IOH.9 22.45,49.68 24.18,49.68 24.59,49.28 28.75,49.28 29.26,48.77 31.29,48.77 31.7,48.36 33.93,48.36 34.34,47.95 36.17,47.95 36.58,47.55 38.3,47.55 38.81,47.04 43.48,47.04 45.01,45.52 46.13,45.52 46.84,44.81 46.84,41.15 46.53,40.84 v46.53,40.23
  Bottom 0.203: v46.63,37.19 46.53,37.29 v46.53,40.23
ADC7  (via drill 0.41)
  Top 0.203: U2.22 48.01,34.75 v46.74,34.75 | IOH.10 19.91,49.68 21.74,49.68 22.15,49.28 23.98,49.28 24.38,48.87 28.55,48.87 29.06,48.36 31.09,48.36 31.5,47.95 33.73,47.95 34.14,47.55 35.97,47.55 36.37,47.14 38.1,47.14 38.61,46.63 43.28,46.63 44.81,45.11 45.72,45.11 46.43,44.4 46.43,41.35 45.82,40.74 v45.82,38.81
  Bottom 0.203: v46.74,34.75 45.82,35.66 v45.82,38.81
AREF  (via drill 0.41)
  Top 0.203: U2.20 47.92,36.27 46.84,36.27 v46.74,36.17 | IOH.8 24.99,49.68 29.06,49.68 29.57,49.17 31.5,49.17 31.9,48.77 34.14,48.77 34.54,48.36 36.37,48.36 36.78,47.95 38.51,47.95 39.01,47.45 43.69,47.45 45.21,45.92 47.04,45.92 48.16,44.81 C11.2 47.24,42.86 47.24,40.13 v47.55,39.83
  Bottom 0.203: v46.74,36.17 47.45,36.88 47.45,39.73 v47.55,39.83
ETH_RESET  (via drill 0.41)
  Top 0.203: U3.59 38.35,37.23 v39.42,38.3 R10.1 41.45,37.31 41.45,34.95 42.24,34.16 C20.2
  Bottom 0.203: J4.1 v39.42,38.3
ETH_SEN
  Top 0.203: 31.9,24.81 R3.1 33.02,24.79 | 33.02,24.79 35.64,24.79 Q1.3 | U3.31 31.9,27.23 32.21,26.92 32.51,26.92 33.02,26.42 33.02,24.79
GND  (via drill 0.41, 0.61)
  Top 0.203: C3.1 11.79,19.91 v11.68,19.91 | C12.1 v9.55,24.49 | v11.58,24.49 C13.1 | C24.1 23.27,41.76 v23.57,41.45 | C22.1 22.53,36.8 22.66,36.68 v22.66,35.87 | U3.4 26.98,36.43 v27.03,36.47 27.53,36.47 29.1,38.04 U3.77 29.1,40.7 v28.75,41.05 | U3.68 32.7,40.93 v32.82,41.05 | U3.65 33.9,40.98 v33.83,41.05 34.34,40.95 | U3.63 34.7,40.79 34.54,40.95 34.34,40.95 | U3.64 34.3,40.9 34.34,40.95 | U3.10 26.62,34.03 v27.03,34.44 | U3.14 26.64,32.43 v27.03,32.82 27.01,32.83 U3.13 25.84,32.82 | U3.20 26.88,30.03 27.03,30.18 27.03,30.48 | 27.03,30.48 v27.03,30.68 27.03,31.09 26.88,31.23 U3.17 | U3.19 26.98,30.43 27.03,30.48 | C23.1 v23.57,32.11 | R5.1 21.87,47.24 22.17,47.55 v24.99,47.55 | C17.2 32.49,22.43 v33.43,23.37 | Q1.2 36.68,22.84 v36.68,21.95 36.65,21.92 R6.1 | U3.21 27.9,28.85 | 27.9,28.85 28.3,28.85 | 28.3,28.85 28.7,28.85 | 28.7,28.85 29.1,28.85 | 29.1,28.85 29.5,28.85 | 29.5,28.85 29.9,28.85 | U3.26 29.9,28.85 | U3.25 29.5,28.85 | U3.24 29.1,28.85 | U3.23 28.7,28.85 | U3.22 28.3,28.85 | U3.32 32.3,28.66 32.11,28.85 29.9,28.85 | 27.9,28.85 27.9,29.02 v27.94,29.06 | U3.40 35.5,28.81 35.26,29.06 v35.05,29.06 | U3.38 34.7,28.81 34.95,29.06 v35.05,29.06 | U3.39 35.1,29.01 v35.05,29.06 | U3.41 36.72,30.03 36.47,30.28 36.47,30.48 | 36.47,30.48 36.47,30.89 | 36.47,30.89 36.47,31.7 | 36.47,31.7 v36.47,32 | v36.47,34.04 36.47,34.44 | 36.47,34.44 36.47,34.85 | 36.47,34.85 36.47,35.05 36.68,35.26 37.56,35.26 U3.54 | U3.51 36.57,34.03 36.47,33.93 36.47,33.63 | 36.47,33.63 36.47,33.22 | 36.47,33.22 36.47,32.82 | 36.47,32.82 36.47,32.41 | 36.47,32.41 v36.47,32 | U3.52 36.48,34.43 36.47,34.44 | U3.53 36.49,34.83 36.47,34.85 | U3.45 36.54,31.63 36.47,31.7
  Top 0.203: U3.46 36.5,32.03 v36.47,32 | U3.47 36.5,32.43 36.47,32.41 | U3.48 36.49,32.83 36.47,32.82 | U3.49 36.48,33.23 36.47,33.22 | U3.50 36.48,33.63 36.47,33.63 | U3.42 36.52,30.43 36.47,30.48 | U3.43 36.53,30.83 36.47,30.89 | C20.1 v39.22,34.04 | 44.7,35.46 C8.1 44.72,35.57 | v44.09,34.34 44.7,34.95 44.7,35.46 | v12.39,15.34 12.76,14.98 U1.28 16.01,14.98 U1.33 v15.54,15.44 v15.54,14.12 15.51,14.08 U1.3 | v16.87,15.44 v16.87,14.12 | C2.1 17.09,4.55 v16.46,5.18 | U4.1 15.88,24.28 v14.12,24.28 | C4.1 25.88,18.41 v26.82,17.48 27.76,18.41 C14.1 | R19.2 51.08,26.52 51,26.52 49.89,26.52 49.24,25.87 U6.4 47.89,25.99 46.35,25.99 | U5.4 46.35,25.99 | 46.35,25.99 46.43,26.06 v46.43,26.82 | v58.01,32.92 58.52,33.43 58.52,34.44 58.2,34.77 U2.3 56.6,34.75 55.68,34.75 55.47,34.95 55.47,36.07 55.77,36.37 U2.5 57.7,36.37 v58.12,36.78 | C6.1 v57.1,42.27 | 44.7,35.46 44.91,35.66 45.11,35.46 47.95,35.46 48.03,35.53 U2.21 | U8.7 v34.44,8.23 | C10.1 47.87,9.36 v47.85,9.35 | C21.1 v50.7,9.75 | C30.1 54.88,9.54 v54.86,9.55 | v46.53,13.92 47.54,13.92 C27.1 | R23.1 v55.98,20.73 55.98,21.03 56.96,22.01 SW2.1 | v62.18,10.26 ANT1.2 | C19.1 27.45,46.11 v28.45,46.13 | C11.1 48.06,42.08 v48.06,41.25 | v44.09,41.66 45.1,41.66 C18.1 | C1.1 v9.65,4.37
  Top 0.254: C7.1 59.51,29.57 v58.32,29.57
  Top 0.305: D4.C 36.5,20.78 R6.1 | C16.1 24.89,24.79 24.49,24.38 v24.49,23.77 24.49,23.06 24.79,22.76 C15.1 | J3.5 5.67,16.18 v5.99,15.65 v5.99,14.73 | U2.21 51.4,35.57 v52.12,34.85 | C9.1 v35.66,12.29 | C5.1 41.13,14.44 v40.74,14.83 | U7.5 43.97,10.13 43.59,9.75 42.77,9.75 | 42.77,9.75 41.66,9.75 v41.45,9.55 41.43,9.58 U7.7 | U7.6 42.7,9.83 42.77,9.75 | C28.1 v56.39,18.9 | C25.2 47.26,16.34 v47.35,16.26 47.45,16.15 50.39,16.15 50.7,16.46 51.51,16.46 U9.20 51.53,15.53 v51.61,15.34 | U9.17 53.03,15.65 v53.34,15.34 53.75,14.93 U9.14 | U9.8 52.53,13.21 v52.83,13.51
  Top 0.457: v48.97,27.23 49.71,27.96 D3.C 51.21,28.55 v51.31,28.45 51.31,26.82 51,26.52
  Top 0.914: J3.11 4.27,21.54 v4.27,23.27 | v2.13,23.27 2.03,23.16 J3.10 J3.9 J3.8 J3.7 v2.03,11.68 | v4.37,11.68 4.33,11.72 J3.6
  Bottom 0.203: v9.55,24.49 v11.58,24.49 | v27.03,32.82 v27.03,34.44 v27.03,36.47 26.42,35.87 v22.66,35.87 | v27.03,30.68 v27.03,32.82 | v23.57,32.11 24.28,32.82 v27.03,32.82 | v36.47,32 v36.47,34.04 v39.22,34.04 | v15.54,15.44 v16.87,15.44 | v16.87,14.12 v15.54,14.12 | v27.94,29.06 27.74,29.06 24.49,25.81 v24.49,23.77 | v23.57,41.45 24.38,41.45 v25.91,39.93
  Bottom 0.305: v5.99,15.65 v5.99,14.73 | v51.61,15.34 52.83,15.34 | 52.83,15.34 v53.34,15.34 | v52.83,13.51 52.83,15.34
  Bottom 0.914: v4.27,23.27 v2.13,23.27 | v2.03,11.68 v4.37,11.68
  other vias: 1.52,9.75 1.52,4.88 3.05,1.52 7.32,1.52 10.97,1.52 16.76,1.52 20.42,1.52 26.52,1.52 29.16,4.88 25.91,3.96 20.12,7.32 12.8,7.62 27.13,8.53 31.09,9.14 33.02,14.43 48.16,1.52 1.83,27.74 8.53,27.43 13.41,27.43 17.68,27.43 22.86,27.43 18.9,20.73 24.08,19.81 28.96,36.58 43.89,52.12 62.18,52.12 64.62,49.07 64.62,45.11 64.62,40.84 61.87,39.62 59.74,41.76 34.75,45.11 35.97,42.67 37.19,39.32 41.45,45.72 67.06,32.61 43.48,19.61 29.87,17.07 28.96,21.34 33.83,19.81 13.41,11.58 56.08,30.48 26.21,12.5 59.74,15.75 59.74,13.92 59.74,12.09 59.74,10.26 59.74,19 59.74,21.54 53.04,8.84 60.35,5.18 29.06,32.82 46.43,30.07 57.2,15.14 52.53,48.67 57.91,46.43
  pour Bottom: 24.38,52.43 62.79,52.43 65.23,49.99 65.23,39.62 67.67,37.19 67.67,22.56 62.48,22.56 62.48,1.22 2.44,1.22 1.22,2.44 1.22,28.04 23.77,28.04 24.38,28.65
  pour Top: 2.34,1.02 60.76,1.02 60.96,22.56 67.87,22.56 67.87,37.29 65.43,39.73 65.43,50.09 62.89,52.63 24.18,52.63 24.18,28.75 23.67,28.24 1.02,28.24 1.02,2.34
IO0  (via drill 0.41)
  Top 0.203: v53.44,35.66 53.52,35.58 U2.30 53.52,30.7 53.75,30.48 54.25,30.48 58.52,26.21 v59.33,26.21 | R20.1 28.02,15.7 D5.2 D5.1 29.97,13.92 32.21,16.15 37.19,16.15 38.81,17.78 38.81,19.2 40.95,21.34 49.28,21.34 49.99,22.05 v49.99,23.88 | v55.68,45.72 59.03,49.07 61.67,49.07 63.4,50.8 IOL.1
  Bottom 0.203: v53.44,35.66 53.44,43.48 v55.68,45.72 | v59.33,26.21 55.78,26.21 54.46,24.89 51,24.89 v49.99,23.88
IO1  (via drill 0.41)
  Top 0.203: v54.25,34.75 54.25,31.74 | 54.25,31.74 U2.31 | U1.8 18.4,12.28 v19.3,11.38 | 54.25,31.74 54.25,31.09 58.42,26.92 59.94,26.92 v60.66,26.21 | v31.09,13.21 31.09,14.33 32.51,15.75 37.39,15.75 39.22,17.58 39.22,19 41.15,20.93 49.48,20.93 50.7,22.15 v50.7,23.06 | v55.68,44.6 54.97,45.31 54.97,46.23 58.32,49.58 59.74,49.58 IOL.2
  Bottom 0.203: v54.25,34.75 54.15,34.95 54.15,36.07 53.85,36.37 53.85,42.77 v55.68,44.6 | v31.09,13.21 30.28,12.39 29.36,12.39 25.7,8.74 21.34,8.74 19.3,10.77 v19.3,11.38 | v60.66,26.21 59.94,25.5 55.68,25.5 54.66,24.49 51.21,24.49 50.7,23.98 v50.7,23.06
IO2  (via drill 0.41)
  Top 0.203: v54.56,36.78 54.56,35.76 55.07,35.26 55.07,31.73 U2.32 | v55.68,43.48 54.46,44.7 54.46,46.84 IOL.3
  Bottom 0.203: v54.56,36.78 54.56,42.37 v55.68,43.48
IO3  (via drill 0.41)
  Top 0.203: v56.59,32.41 56.62,32.44 U2.1 | v56.08,42.27 55.58,42.27 54.76,43.08 54.76,43.79 53.95,44.6 53.95,48.87 IOL.4
  Bottom 0.203: v56.59,32.41 56.59,34.65 55.27,35.97 55.27,41.45 v56.08,42.27
IO4  (via drill 0.41)
  Top 0.203: v57.81,34.04 56.69,34.04 U2.2 | v56.08,41.15 54.36,42.88 54.36,43.59 53.54,44.4 53.54,50.6 IOL.5
  Bottom 0.203: v57.81,34.04 55.68,36.17 55.68,40.64 v56.08,41.15
IO5
  Top 0.203: IOL.6 50.9,50.7 50.9,48.77 53.14,46.53 53.14,44.2 53.95,43.38 53.95,42.37 55.12,41.19 U2.9
IO6
  Top 0.203: IOL.7 52.73,46.33 52.73,43.99 53.54,43.18 53.54,42.06 54.32,41.28 U2.10
IO7
  Top 0.203: IOL.8 47.55,48.97 49.38,48.97 52.32,46.02 52.32,43.79 53.14,42.98 53.14,41.55 53.52,41.17 U2.11
IO8  (via drill 0.41)
  Top 0.203: 46.22,22.05 U5.1 U6.1 48.03,22.05 48.87,22.05 49.17,22.35 49.17,23.67 48.87,23.98 45.11,23.98 44.81,24.28 44.81,26.82 44.36,27.27 R11.1 44.36,29.93 v45.21,30.79 | v52.73,38.41 52.72,38.41 U2.12 52.72,40.63 52.73,40.64 52.73,42.77 51.92,43.59 51.92,45.72 49.17,48.46 46.43,48.46 44.09,50.8 IOH.1
  Bottom 0.203: v45.21,30.79 45.21,30.99 45.26,31.04 46.69,31.04 49.89,34.24 49.89,34.65 52.73,37.49 v52.73,38.41
IO9  (via drill 0.41)
  Top 0.203: IOH.2 40.34,49.58 44.7,49.58 46.23,48.06 48.97,48.06 51.51,45.52 51.51,42.88 v51.92,42.47 51.92,42.06 U2.13
  Bottom 0.203: J4.2 43.38,38.3 46.02,40.95 47.04,40.95 47.45,40.54 48.87,40.54 50.8,42.47 v51.92,42.47
LINKLED  (via drill 0.41)
  Top 0.203: U3.66 33.53,39.68 33.53,37.9 33.22,37.59 v31.9,37.59 | v11.18,45.72 10.16,46.74 1.83,46.74 0.91,45.82 0.91,42.96 J5.10
  Bottom 0.203: v31.9,37.59 31.5,38 29.87,38 29.06,38 21.34,45.72 20.12,45.72 v11.18,45.72
MISO_0
  Top 0.203: U1.17 20.46,17.18 J1.1
MISO_1  (via drill 0.41)
  Top 0.203: v50.39,37.8 50.39,38.81 49.52,39.68 U2.16 49.58,40.32 49.48,40.42 49.48,40.64 49.53,40.69 | U3.27 30.3,27.25 29.46,26.42 v29.26,26.42 | v38.81,25.2 38.91,25.09 38.91,24.99 39.93,23.98 43.18,23.98 | 43.18,23.98 43.83,23.33 U5.2 U6.2 | v61.16,27.23 61.67,27.74 61.67,29.21 J2.1 62.94,30.43 64.21,29.16 66.14,29.16 66.75,28.55 66.75,24.69 v66.04,23.98 | 43.18,23.98 43.18,29.87 v45.52,32.21 45.72,32.21 48.06,29.87 v48.26,29.87 | U9.5 50.31,13.43 50.29,13.41 v50.29,12.75 | IOH.5 32.61,49.68 34.54,49.68 34.95,49.28 36.78,49.28 37.19,48.87 38.91,48.87 39.42,48.36 44.09,48.36 45.62,46.84 48.36,46.84 50.29,44.91 50.29,42.77 49.53,42.01 49.53,40.69 | 49.53,40.69 49.58,40.74
  Bottom 0.203: v50.39,37.8 50.39,36.47 48.97,35.05 48.97,34.54 46.63,32.21 v45.52,32.21 | v29.26,26.42 29.26,25.81 29.97,25.09 36.98,25.09 37.19,25.3 38.71,25.3 v38.81,25.2 | v61.16,27.23 56.19,27.23 54.25,25.3 52.73,25.3 48.26,29.77 v48.26,29.87 | v50.29,12.75 50.29,16.46 57,23.16 65.23,23.16 v66.04,23.98
MOSI_0
  Top 0.203: J1.4 23.42,14.22 21.54,14.22 20.93,14.83 20.93,15.75 20.2,16.48 U1.16
MOSI_1  (via drill 0.41)
  Top 0.203: U3.28 30.7,26.53 v30.38,26.21 | 41.07,26.01 v39.62,26.01 39.62,27.13 40.23,27.74 41.96,27.74 42.37,28.14 42.37,30.79 v43.08,31.5 | 41.07,26.01 U6.5 | v56.69,40.03 56.39,40.03 55.37,39.01 54.66,39.01 52.83,37.19 v51.31,37.19 51.31,38.61 50.32,39.59 U2.15 50.29,40.29 50.29,42.06 50.7,42.47 50.7,45.11 48.56,47.24 45.82,47.24 44.3,48.77 39.62,48.77 39.12,49.28 37.39,49.28 36.98,49.68 35.15,49.68 IOH.4 | 41.07,26.01 40.94,25.88 U5.5 | U9.4 49.79,13.93 v49.28,13.41 | v64.82,23.98 64.31,24.49 64.31,26.62 65.48,27.79 J2.4
  Bottom 0.203: v30.38,26.21 31.09,25.5 36.68,25.5 37.19,26.01 v39.62,26.01 | v43.08,31.5 46.53,31.5 49.48,34.44 49.48,34.95 51.31,36.78 v51.31,37.19 | J2.4 65.02,27.94 63.8,29.16 61.37,29.16 60.76,28.55 57.81,28.55 57.2,29.16 57.2,30.79 58.73,32.31 58.73,34.54 56.59,36.68 56.59,39.93 v56.69,40.03 | v49.28,13.41 49.38,13.51 49.38,16.15 56.79,23.57 64.41,23.57 v64.82,23.98
N$1
  Top 0.203: U1.2 15.01,9.28 15.54,8.74 16.92,8.74 17.25,8.41 | 17.25,8.41 X1.2 | C2.2 18.87,7.44 17.98,8.33 X1.2 | X1.2 17.25,8.41
N$2
  Top 0.203: U1.1 14.43,12.2 14.43,10.67 12.09,8.33 X1.1 6.96,4.39 C1.2
N$3
  Top 0.203: U3.75 29.9,41.58 30.58,42.27 34.04,42.27 35.66,43.89 X3.2 arc90 40.62,43.76 42.67,43.36 C18.2
N$4
  Top 0.203: U3.55 38.68,35.63 38.81,35.76 38.81,36.17 | 38.81,36.17 38.81,36.37 | 38.81,36.37 38.81,36.68 38.66,36.83 U3.58 | U3.57 38.75,36.43 38.81,36.37 | R7.1 38.81,36.17
N$5
  Top 0.203: U3.76 29.5,43.8 X3.1 arc90 30.3,44.42 C19.2
N$6
  Top 0.203: X4.2 48.59,7.29 | 48.59,7.29 49.07,7.77 49.07,8.64 49.47,9.03 C10.2 | U9.9 53.03,11.79 52.83,11.58 52.32,11.23 52.32,9.35 49.99,7.01 48.87,7.01 48.59,7.29
N$7  (via drill 0.41)
  Top 0.203: U1.9 18.92,12.98 v19.41,12.5 | 28.57,12.29 D5.3 27.53,11.89 v27.43,11.79
  Bottom 0.203: v19.41,12.5 20.22,11.68 20.22,10.46 21.54,9.14 25.3,9.14 25.81,9.65 27.43,11.28 v27.43,11.79
N$8
  Top 0.203: U1.13 19.46,14.98 20.93,13.51 20.93,12.29 21.54,11.68 25.6,11.68
  Top 0.254: 25.6,11.68 27.23,10.06 C26.1
N$9
  Top 0.203: R1.2 9.55,16.56 10.46,15.65 10.46,14.02 10.87,13.61 12.09,13.61 12.46,13.98 U1.30
N$10
  Top 0.203: R22.2 D7.A
N$11
  Top 0.203: R2.2 11.38,14.63 11.43,14.58 | 11.43,14.58 11.58,14.43 | U1.29 11.53,14.48 11.43,14.58
N$12
  Top 0.203: U9.10 53.54,12.36 53.54,11.68 53.12,11.27 C21.2 53.95,9.74 53.95,9.25 56.19,7.01 X4.1
N$13
  Top 0.279: U9.13 56.02,14.43 L3.1
  Top 0.508: L4.1 56.52,13.98 L3.1
N$14
  Top 0.305: R13.1 32.49,18.49 D4.A
N$15
  Top 0.254: R11.2 D3.A
N$16
  Top 0.203: 57.19,44.81 C6.2
  Top 0.254: U2.8 56.66,38.81 58.73,38.81 61.16,41.25 X2.2 58.57,45.47 57.91,44.81 57.19,44.81
N$17
  Top 0.203: X2.1 61.16,36.47 60.76,36.88 60.86,36.98 60.86,37.59 60.6,37.85 | 60.55,37.9 60.6,37.85 | 56.69,37.9 56.89,38.1 59.84,38.1 60.35,38.1 60.6,37.85
  Top 0.254: 56.69,37.9 U2.7 | C7.2 59.61,31.37 61.06,32.82 61.06,35.71 X2.1
N$18
  Top 0.203: U3.1 25.91,37.72 25.91,38.71 25.81,38.81 24.89,39.73 24.89,41.76 25.3,42.16 R4.2
N$19
  Top 0.203: R5.2 24.87,46.23 R4.1
N$20
  Top 0.203: R14.2 4.17,25.4 3.35,26.21 3.35,32.34 J5.11
N$22
  Top 0.203: R12.2 4.06,27.43 3.76,27.74 3.76,42.65 J5.9
N$23
  Top 0.203: R15.1 C23.2 R16.2
N$24
  Top 0.203: R21.2 D6.A
N$25
  Top 0.203: U9.16 53.53,18.27 R23.2
N$26
  Bottom 0.762: J5.13 J5.14
  Bottom 1.778: J5.13 9.25,45.4 9.25,45.01 | J5.14 9.25,29.99 9.25,30.79
N$27
  Top 0.305: U9.19 52.03,17.26 51.82,17.48 50.6,17.48 50.29,17.17 C25.1
N$28
  Top 0.203: R18.2 C24.2 R17.1
N$29
  Top 0.279: U9.12 55.36,13.93 55.58,13.72 55.58,13.17 L3.2
  Top 0.508: L5.2 56.52,12.23 L3.2
N$30
  Top 0.279: U9.11 54.58,12.47 C30.2
  Top 0.508: L5.1 56.51,10.53 C30.2
N$31
  Top 0.203: U5.3 U6.3 48.38,24.6 48.46,24.69 51.04,24.69 R19.1
N$32
  Top 0.508: ANT1.1 C31.1
N$34
  Top 0.508: C31.2 58.43,15.7 L4.2
NRST_1  (via drill 0.41)
  Top 0.203: U2.29 52.72,30.59 53.24,30.07 54.05,30.07 58.73,25.4 J2.5 62.99,25.35 62.99,24.28 64.96,22.31 SW2.2 | POWER.3 33.02,3.66 32.36,4.32 | 32.31,4.37 32.36,4.32 | 32.36,4.32 29.87,6.81 29.87,8.94 29.87,10.03 C26.2 29.84,10.13 30.79,11.07 30.79,11.68 31.8,12.7 31.8,14.33 32.82,15.34 37.59,15.34 39.62,17.37 39.62,18.8 41.35,20.52 49.68,20.52 51.21,22.05 51.21,22.45 51.61,22.86 v51.61,23.67
  Bottom 0.203: J2.5 62.89,25.4 62.59,25.09 56.39,25.09 55.88,25.09 54.86,24.08 52.12,24.08 51.71,23.67 v51.61,23.67
RESET_0  (via drill 0.41)
  Top 0.203: U1.24 14.51,17.76 14.83,18.09 20.42,18.09 21.34,17.17 22.35,17.17 23.16,17.17 v23.37,16.97
  Bottom 0.203: v23.37,16.97 23.37,11.73 J1.5
RXDLED
  Top 0.203: U1.10 19.54,13.48 20.12,12.9 20.12,10.06 21.13,9.04 22.43,7.75 D6.C
RXIN
  Top 0.203: J5.8 15.04,33.93 13.21,35.76 11.79,35.76 10.97,36.58 10.97,42.57 11.79,43.38 15.24,43.38 20.02,38.61 21.54,38.61 R18.1 22.63,39.55 23.98,38.2 23.98,36.27 24.62,35.63 U3.6
RXIP
  Top 0.203: J5.7 12.29,34.54 10.57,36.27 10.57,42.77 11.58,43.79 18.69,43.79 19.91,45.01 21.44,45.01 R17.2 22.63,43.61 23.88,42.37 24.38,41.86 24.38,38.51 24.38,36.47 24.79,36.07 24.83,36.03 U3.5
SCK_0
  Top 0.203: U1.15 19.98,15.98 20.52,15.44 20.52,14.58 J1.3
SCK_1  (via drill 0.41)
  Top 0.203: v49.28,38.81 48.36,38.81 | 48.36,38.81 48.08,38.81 U2.17 | U3.30 31.5,26.62 v31.9,26.21 | 42.16,26.72 42.67,26.21 42.67,25.09 42.27,24.69 41.27,24.69 U6.6 U5.6 | v40.54,26.92 40.74,26.72 42.16,26.72 | 42.16,26.72 42.77,27.33 42.77,30.07 44.7,32 44.7,32.51 45.21,33.02 v46.33,33.02 46.33,32.31 46.84,31.8 47.45,31.8 v49.38,29.87 | U9.3 48.77,14.43 v48.67,14.33 | IOH.6 30.07,49.68 31.8,49.68 32.21,49.28 34.34,49.28 34.75,48.87 36.58,48.87 36.98,48.46 38.71,48.46 39.22,47.95 43.89,47.95 45.41,46.43 48.16,46.43 49.89,44.7 49.89,43.18 49.07,42.37 49.07,41.45 48.77,41.15 48.77,40.03 48.36,39.62 48.36,38.81
  Bottom 0.203: v49.28,38.81 48.46,38 48.46,34.65 46.84,33.02 v46.33,33.02 | v40.54,26.92 39.22,26.92 38.71,26.42 36.98,26.42 36.47,25.91 32.21,25.91 v31.9,26.21 | v49.38,29.87 49.48,29.77 49.48,29.16 52.93,25.7 54.05,25.7 56.29,27.94 J2.3 64.31,26.57 64.31,24.79 63.5,23.98 56.59,23.98 48.67,16.05 v48.67,14.33
SPDLED  (via drill 0.41)
  Top 0.203: U3.67 33.1,38.69 v32.82,38.41
  Bottom 0.203: v32.82,38.41 29.26,38.41 26.72,40.95 21.54,46.13 19,46.13 11.99,46.13 11.38,46.74 5.99,46.74 3.76,44.5 3.76,34.75 3.76,32.74 J5.12
SS_1  (via drill 0.41)
  Top 0.203: R6.2 34.77,21.03 Q1.1 34.75,22.89 34.75,23.67 | U3.29 31.1,23.97 31.29,23.77 32.51,23.77 32.92,24.18 34.24,24.18 34.75,23.67 | U2.14 51.1,40.28 v51.1,41.66 51.1,45.31 48.77,47.65 46.02,47.65 44.5,49.17 39.83,49.17 39.32,49.68 37.69,49.68 IOH.3 | v35.76,23.77 34.85,23.77 34.75,23.67 | v43.79,32.41 43.59,32.21 42.77,32.21 41.96,31.39 41.96,28.55 41.66,28.25 40.13,28.25 37.8,25.91 v37.8,24.49
  Bottom 0.203: v51.1,41.66 51,41.66 48.06,38.71 48.06,34.85 46.94,33.73 46.02,33.73 44.7,32.41 v43.79,32.41 | 35.76,23.88 v35.76,23.77 37.08,23.77 v37.8,24.49
TXDLED
  Top 0.203: U1.11 19.65,13.98 20.52,13.11 20.52,10.26 21.84,8.94 24.28,8.94 24.38,8.84 D7.C
TXON
  Top 0.203: J5.2 15.34,40.84 17.48,38.71 17.48,36.47 19.41,34.54 19.41,29.46 20.02,28.85 21.34,28.85 R16.1 23.27,30.07 24.08,30.89 24.18,30.99 24.38,31.19 24.38,33.93 24.89,34.44 25.81,34.44 U3.9
TXOP
  Top 0.203: J5.1 15.24,42.16 17.88,39.52 17.88,36.68 19.3,35.26 21.44,35.26 R15.2 23.77,34.14 24.49,34.85 25.8,34.85 U3.8
U_VBUS
  Top 0.203: 7.62,18.8 L1.1
  Top 0.406: J3.1 7.62,18.8
UCAP
  Top 0.203: C3.2 11.79,16.97 11.79,16.87 11.89,16.97 13.37,15.48 U1.27
USB_D+
  Top 0.203: J3.3 5.69,17.48 6.6,16.56 6.6,16.15 8.13,14.63 R2.1
USB_D-
  Top 0.203: J3.2 5.69,18.09 7.11,16.66 R1.1

### Text on the board
tPlace: My Smart Home | Project Platform | V2.0
bPlace: AREF | GND | A7 | A6 | 13 | 12 | 11 | 10 | 9 | 8 | 7 | 6 | 5 | 4 | 3 | 2 | 1 | 0 | # | # | # | # | # | # | DIGITAL | [#=PWM] | TX | RX | Design by Hell Prototypes | www.hellprototypes.com | SDA | SCL | ANALOG IN | UNUSE | 5V | RESET | 3V3 | 5V | GND | A0 | A1 | A2 | A3 | A4 | A5